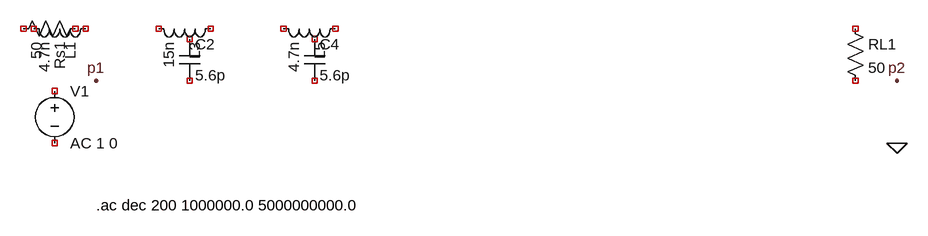
[diagram p0: schematic demo1_1ghz_lpf.asc]
demo1_1ghz_lpf.asc, the LTspice schematic file:
Version 4
SHEET 1 1280 720
SYMBOL voltage 32 144 R0
SYMATTR InstName V1
SYMATTR Value AC 1 0
SYMBOL res 80 48 R90
SYMATTR InstName Rs1
SYMATTR Value 50
SYMBOL ind 96 48 R90
SYMATTR InstName L1
SYMATTR Value 4.7n
SYMBOL cap 224 80 R0
SYMATTR InstName C2
SYMATTR Value 5.6p
SYMBOL ind 288 48 R90
SYMATTR InstName L3
SYMATTR Value 15n
SYMBOL cap 416 80 R0
SYMATTR InstName C4
SYMATTR Value 5.6p
SYMBOL ind 480 48 R90
SYMATTR InstName L5
SYMATTR Value 4.7n
SYMBOL res 1248 48 R0
SYMATTR InstName RL1
SYMATTR Value 50
TEXT 96 336 Left 2 !.ac dec 200 1000000.0 5000000000.0
FLAG 96 144 p1
FLAG 1328 144 p2
FLAG 1328 240 0

The netlist it stands for:
* demo1_1ghz_lpf.asc
V1 NC_01 NC_02 AC 1 0
Rs1 NC_03 NC_04 50
L1 NC_05 NC_06 4.7n
C2 NC_07 NC_08 5.6p
L3 NC_09 NC_10 15n
C4 NC_11 NC_12 5.6p
L5 NC_13 NC_14 4.7n
RL1 NC_15 NC_16 50
.ac dec 200 1000000.0 5000000000.0
.backanno
.end